# Altium schematic sheet Power.SchDoc
size A
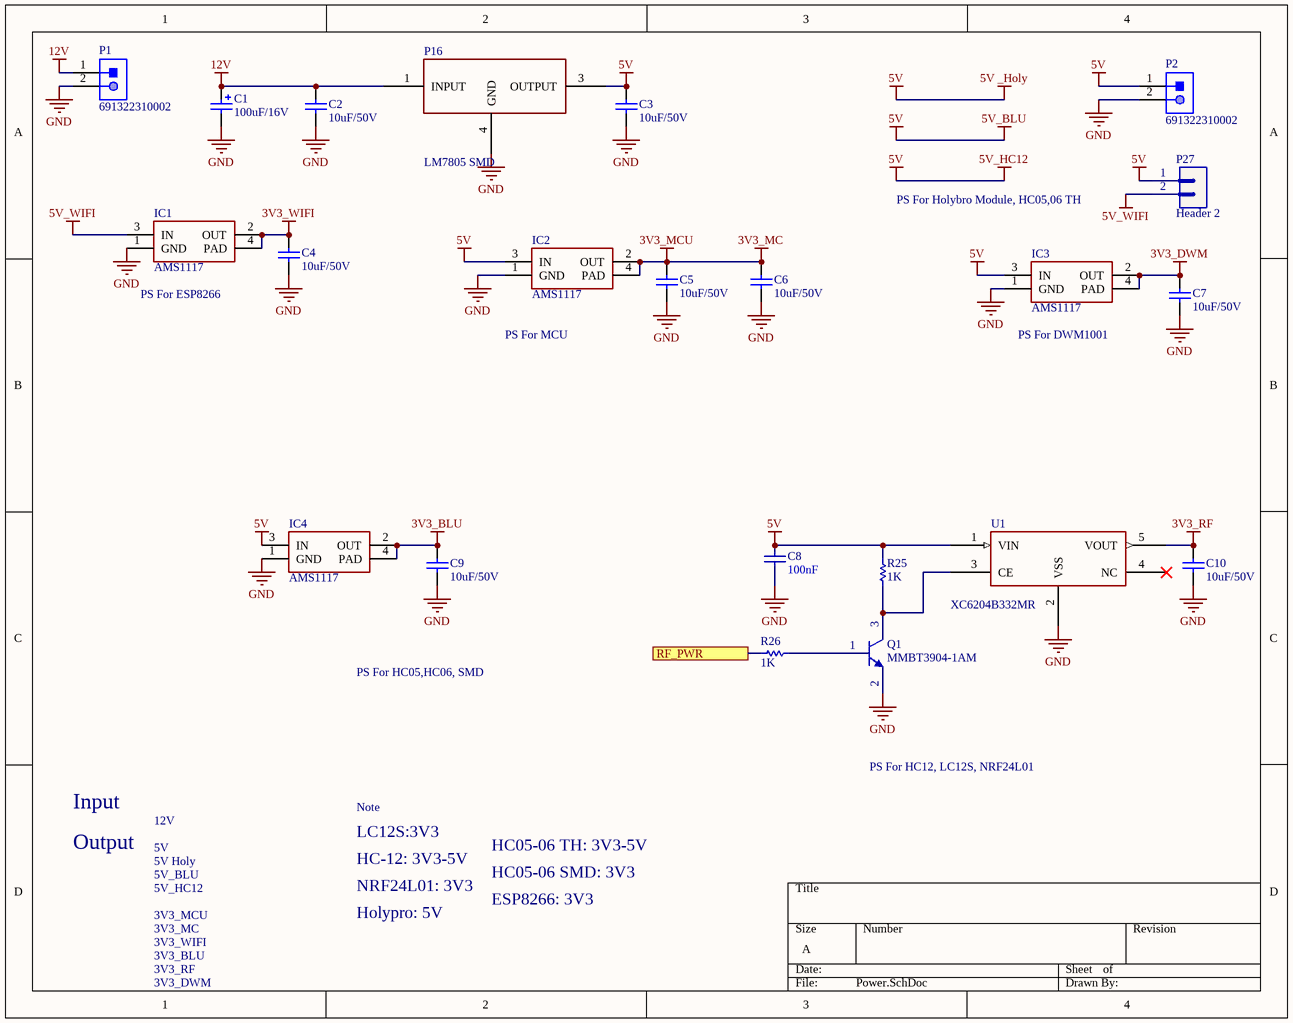
[diagram p0: Power.SchDoc]

## Parts
C1  value 100uF/16V  [CAP_SM_TAN]  (hidden comment: TAJB107M006RNJ)
C2  value 10uF/50V  [CAP-SM-0805]  (hidden comment: Cap-10uF-50V-0805)
C3  value 10uF/50V  [CAP-SM-0805]  (hidden comment: Cap-10uF-50V-0805)
C4  value 10uF/50V  [CAP-SM-0805]  (hidden comment: Cap-10uF-50V-0805)
C5  value 10uF/50V  [CAP-SM-0805]  (hidden comment: Cap-10uF-50V-0805)
C6  value 10uF/50V  [CAP-SM-0805]  (hidden comment: Cap-10uF-50V-0805)
C7  value 10uF/50V  [CAP-SM-0805]  (hidden comment: Cap-10uF-50V-0805)
C8  value 100nF  [CAP-SM-0805]  (hidden comment: Cap Non-Pol SMD)
C9  value 10uF/50V  [CAP-SM-0805]  (hidden comment: Cap-10uF-50V-0805)
C10  value 10uF/50V  [CAP-SM-0805]  (hidden comment: Cap-10uF-50V-0805)
IC1  AMS1117  [SOT223]
IC2  AMS1117  [SOT223]
IC3  AMS1117  [SOT223]
IC4  AMS1117  [SOT223]
P1  691322310002  [691322310002]
P2  691322310002  [691322310002]
P16  LM7805 SMD  [D2PAK_STM]
P27  Header 2  [JP2]
Q1  MMBT3904-1AM  [SOT23_NEX]
R25  value 1K  [RES-SM-0805]  (hidden comment: Resistor 1/4W)
R26  value 1K  [RES-SM-0805]  (hidden comment: Resistor 1/4W)
U1  XC6204B332MR  [XC6204/05_SOT-00]

## Ports
RF_PWR (in)

## Nets
3V3_BLU: C9.2 IC4.2(OUT) IC4.4(PAD)
3V3_DWM: C7.2 IC3.2(OUT) IC3.4(PAD)
3V3_MC: C5.2 C6.2 IC2.2(OUT) IC2.4(PAD)  [also labelled 3V3_MCU]
3V3_RF: C10.2 U1.5(VOUT)
3V3_WIFI: C4.2 IC1.2(OUT) IC1.4(PAD)
5V: C3.2 C8.2 IC2.3(IN) IC3.3(IN) IC4.3(IN) P2.1 P16.3(OUTPUT) P27.1 R25.2 U1.1(VIN)  [also labelled 5V _Holy, 5V_BLU, 5V_HC12]
5V_WIFI: IC1.3(IN) P27.2
12V: C1.1 C2.2 P1.1 P16.1(INPUT)
GND: C1.2 C2.1 C3.1 C4.1 C5.1 C6.1 C7.1 C8.1 C9.1 C10.1 IC1.1(GND) IC2.1(GND) IC3.1(GND) IC4.1(GND) P1.2 P2.2 P16.4(GND) Q1.2(E) U1.2(VSS)
RF_PWR: R26.1 ; port RF_PWR
NetQ1_1: Q1.1(B) R26.2
NetQ1_3: Q1.3(C) R25.1 U1.3(CE)

Not connected (* = marked no-connect by the designer): U1 4(NC)*

## Notes on the sheet
- PS For Holybro Module, HC05,06 TH
- (near IC1) PS For ESP8266
- PS For MCU
- (near IC3) PS For DWM1001
- PS For HC05,HC06, SMD
- PS For HC12, LC12S, NRF24L01
- Input
- 12V
- Note
- LC12S:3V3
- Output
- 5V
- 5V Holy
- 5V_BLU
- 5V_HC12
- HC-12: 3V3-5V
- NRF24L01: 3V3
- HC05-06 TH: 3V3-5V
- HC05-06 SMD: 3V3
- ESP8266: 3V3
- 3V3_MC
- 3V3_WIFI
- 3V3_BLU
- 3V3_RF
- 3V3_MCU
- Holypro: 5V
- 3V3_DWM

## Library data of the parts
C1 = Cap-Tan-100uF-16V: Manufacturer: Nichicon; Manufacturer Part Number: UWX1C101MCL1GB; Local Supplier: icdayroi; Local Supplier Link: https://icdayroi.com/tu-tantalum-100uf-16v-smd6032; Supplier 1: Digikey; Supplier 1 Part Number: 493-2105-1-ND; Supplier 1 Link: https://www.digikey.com/product-detail/en/nichicon/UWX1C101MCL1GB/493-2105-1-ND/590080
C2-C7 C9 C10 = Cap-10uF-50V-0805: CAP CER 10UF 50V X5R 0805; Manufacturer: Yageo; Manufacturer Part Number: CC0805KKX5R9BB106; Local Supplier: thegioiic; Local Supplier Link: https://thegioiic.com/products/tu-10uf-50v-0805; Supplier 1: Digikey; Supplier 1 Link: https://www.digikey.com/product-detail/en/yageo/CC0805KKX5R9BB106/311-3499-2-ND/7164383; Supplier 1 Part Number: 311-3499-2-ND
C8 = Cap Non-Pol SMD: Capacitor
IC1-IC4 = AMS1117: Available in 1.8V, 2.5V, 2.85V, 3.3V, 5V, and  Adjustable Versions; Value: LM317
P1 P2 = 691322310002: WR-TBL Serie 322 Horizontal PCB Header, Pluggable, pitch 3.81mm, 2p; Compliance: RoHS; Modularity: No; Pin Number: 2; Rated Current [UL]: 10A; Working Voltage [UL]: 300VAC; ComponentLink1Description: Manufacturer; ComponentLink1URL: http://www.we-online.de; ComponentLink2URL: https://katalog.we-online.de/em/datasheet/691322310002.pdf; ComponentLink2Description: Datasheet; Mounting Technology: THT; Part Number: 691322310002; Packaging: Box; Operating Temperature: -40 to +105degC; PCB/Cable/Panel: PCB; Pitch: 3.81mm; Published Date: October 2019; Type: Horizontal; Publisher: Wurth Elektronik; Application: Pluggable
P27 = Header 2: Header, 2-Pin; LatestRevisionDate: 17-Jul-2002; LatestRevisionNote: Re-released for DXP Platform.; Publisher: Altium Limited
R25 R26 = RES
U1 = XC6204B332MR: Vendor: Torex Semiconductor; Built_By: EMA_UL_Team; SourceLibrary: Torex_2016-07-05_1; Manufacturer_Part_Number: XC6204B332MR; Copyright: Copyright (C) 2018 Accelerated Designs. All rights reserved; RefDes: RefDes; Type: DEV
P16 = LM7805 SMD: Local Supplier: *; Local Supplier Link: *; Local Supplier Part Number: *; Mannufacture: *; Mannufacture Part Number: *